# EAGLE design tremolo (EAGLE 9.3.0)

## Sheet 1 of 3
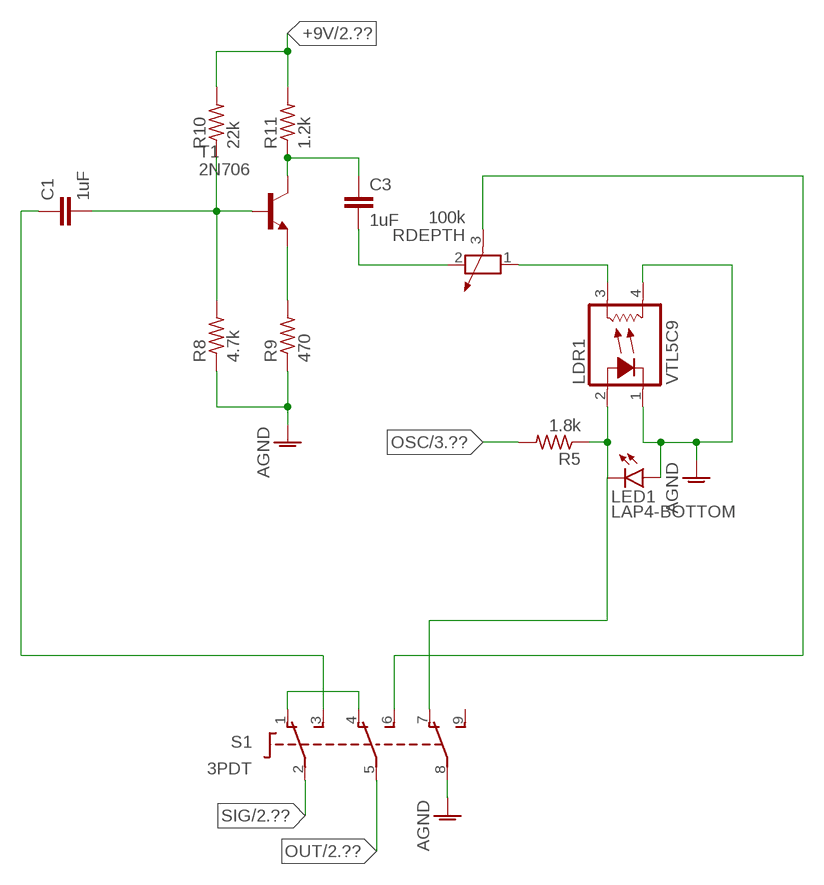
[diagram p0: schematic, sheet 1]

### Parts
C1  1uF  C-EU025-024X044  [C025-024X044]
C3  1uF  C-EU025-024X044  [C025-024X044]
LDR1  VTL5C9  [VTL5C]
LED1  LAP4-BOTTOM  [P47F-BOTTOM]
R5  1.8k  R-US_0204/2V  [0204V]
R8  4.7k  R-US_0204/2V  [0204V]
R9  470  R-US_0204/2V  [0204V]
R10  22k  R-US_0204/2V  [0204V]
R11  1.2k  R-US_0204/2V  [0204V]
RDEPTH  100k  POTENTIOMETER_PT-10  [PT-10]
S1  3PDT  [3PDT]
T1  2N706  [TO18]

### Nets
+9V: R10.2 R11.2 ; also sheet 2,3
AGND: LDR1.1(C) LDR1.4(L2) LED1.A R8.1 R9.1 S1.8(P3) ; also sheet 2,3
EFX: C3.1 R11.1 RDEPTH.3 S1.6(S2) T1.3(C)
IN: C1.1 S1.3(S1)
N$1: R9.2 T1.1(E)
N$2: C1.2 R8.2 R10.1 T1.2(B)
N$5: LDR1.2(A) LED1.C R5.1 S1.7(O3)
N$7: LDR1.3(L1) RDEPTH.1
N$8: S1.1(O1) S1.4(O2)
N$10: C3.2 RDEPTH.2
OSC: R5.2 ; also sheet 3
OUT: S1.5(P2) ; also sheet 2
SIG: S1.2(P1) ; also sheet 2
Unconnected: S1.9(S3)

## Sheet 2 of 3
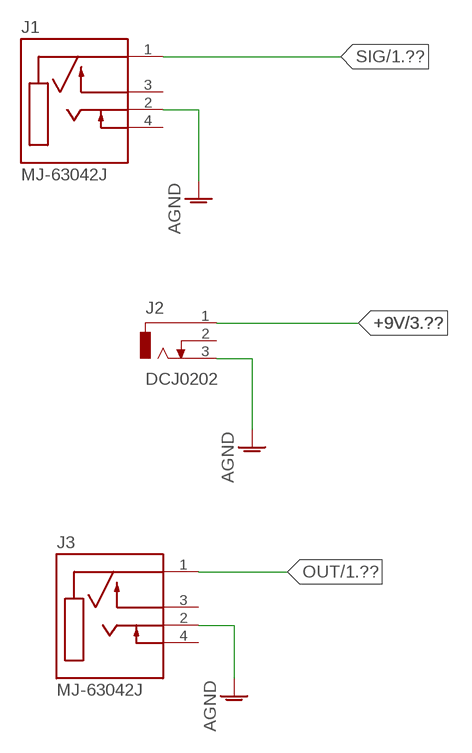
[diagram p1: schematic, sheet 2]

### Parts
J1  MJ-63042J  [CUI_MJ-63042J]
J2  DCJ0202  [DCJ0202]
J3  MJ-63042J  [CUI_MJ-63042J]

### Nets
+9V: J2.1 ; also sheet 1,3
AGND: J1.2(TIP) J2.3 J3.2(TIP) ; also sheet 1,3
OUT: J3.1(SLEEVE) ; also sheet 1
SIG: J1.1(SLEEVE) ; also sheet 1
Unconnected: J1.3(SLEEVE_SWITCH) J1.4(TIP_SWITCH) J2.2 J3.3(SLEEVE_SWITCH) J3.4(TIP_SWITCH)

## Sheet 3 of 3
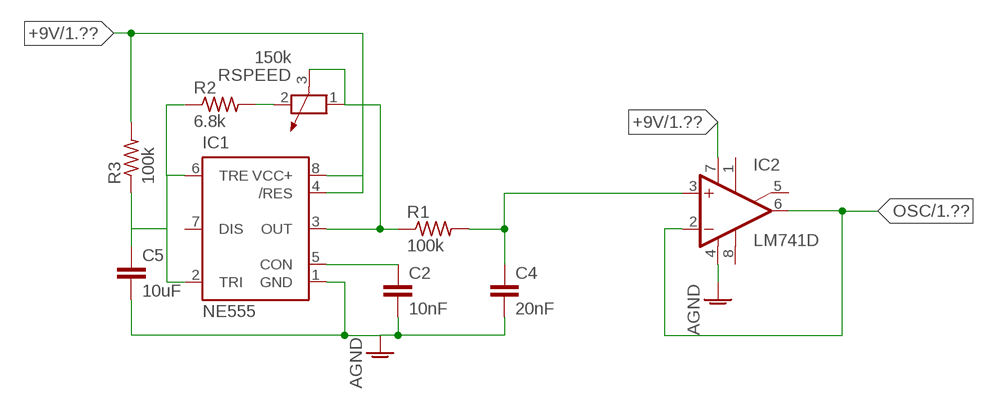
[diagram p2: schematic, sheet 3]

### Parts
C2  10nF  C-EU025-024X044  [C025-024X044]
C4  20nF  C-EU025-024X044  [C025-024X044]
C5  10uF  C-EU025-024X044  [C025-024X044]
IC1  NE555  [DIL-08]
IC2  LM741D  [SO08]
R1  100k  R-US_0204/2V  [0204V]
R2  6.8k  R-US_0204/2V  [0204V]
R3  100k  R-US_0204/2V  [0204V]
RSPEED  150k  POTENTIOMETER_PT-10  [PT-10]

### Nets
+9V: IC1.4(/RES) IC1.8(VCC+) IC2.7(V+) R3.2 ; also sheet 1,2
AGND: C2.2 C4.2 C5.2 IC1.1(GND) IC2.4(V-) ; also sheet 1,2
N$3: C2.1 IC1.5(CON)
N$4: IC1.3(OUT) R1.1 RSPEED.1 RSPEED.3
N$6: C5.1 IC1.2(TRI) IC1.6(TRE) R2.1 R3.1
N$9: R2.2 RSPEED.2
OSC: IC2.2(-IN) IC2.6(OUT) ; also sheet 1
WAV: C4.1 IC2.3(+IN) R1.2
Unconnected: IC1.7(DIS) IC2.1(ON1) IC2.5(ON2) IC2.8(OPT)

## Library data of the parts
C1-C5 = rcl:C-EU: CAPACITOR, European symbol; SPICEPREFIX: C
IC1 = st-microelectronics:NE555: General purpose bipolar Timer; MF: Arrow Electronics; MPN: NE555N; OC_FARNELL: 1467742; OC_NEWARK: 89K1486
IC2 = linear:*741: OP AMP
J1 J3 = MJ-63042J:MJ-63042J: Check prices <https://snapeda.com/parts/MJ-63042J/CUI%20Devices/view-part/?ref=eda>; ARROW_ELECTRONICS-PURCHASE-URL: https://snapeda.com/shop?store=Arrow+Electronics&id=4973935; AVAILABILITY: Warning; CUI_PURCHASE_URL: https://www.cuidevices.com/product/interconnect/connectors/audio-connectors/jacks/mj-63042j?utm_source=snapeda.com&utm_medium=referral&utm_campaign=snapedaBOM; DESCRIPTION: 6.35 mm, Mono, Right Angle, Through Hole, 2 Conductors, 2 Internal Switches, Audio Jack Connector; DIGIKEY-PURCHASE-URL: https://snapeda.com/shop?store=DigiKey&id=4973935; MF: CUI Devices; MOUSER-PURCHASE-URL: https://snapeda.com/shop?store=Mouser&id=4973935; MP: MJ-63042J; PACKAGE: Package; PRICE: None
J2 = con-jack:DCJ0202: DC POWER JACK Source: DCJ0202.pdf; OC_FARNELL: unknown; OC_NEWARK: unknown; SPICEPREFIX: M
LDR1 = optocoupler:VTL5C*: Low Cost Axial Vactrols Source: www.perkinelmer.com/opto ... vtl5c9_c10.pdf; MF: VACTEC PHOTO; MPN: VTL5C9; OC_FARNELL: 2067857; OC_NEWARK: 95F9033
LED1 = led:*P4: PointLED® Enhanced Thinfilm LED TOP & BOTTOM mount LS P47F, LR P47F, LA P47F, LY P47F, LT P4SG, LB P4SG, LW P4SG Source: http://catalog.osram-os.com .. LA_LR_LS_LY_P47F_Pb_free.pdf
R1-R3 R5 R8-R11 = rcl:R-US_: RESISTOR, American symbol; SPICEPREFIX: R
RDEPTH RSPEED = rcl:POTENTIOMETER_: Potentiometer; SPICEMODEL: POT; SPICEPREFIX: X
S1 = switch:3PDT: 3PDT 9 pin footswitch SF17020F-0302-21R-L Source: 3PDT.jpg
T1 = transistor:2N706: NPN TRANSISTOR

## Board
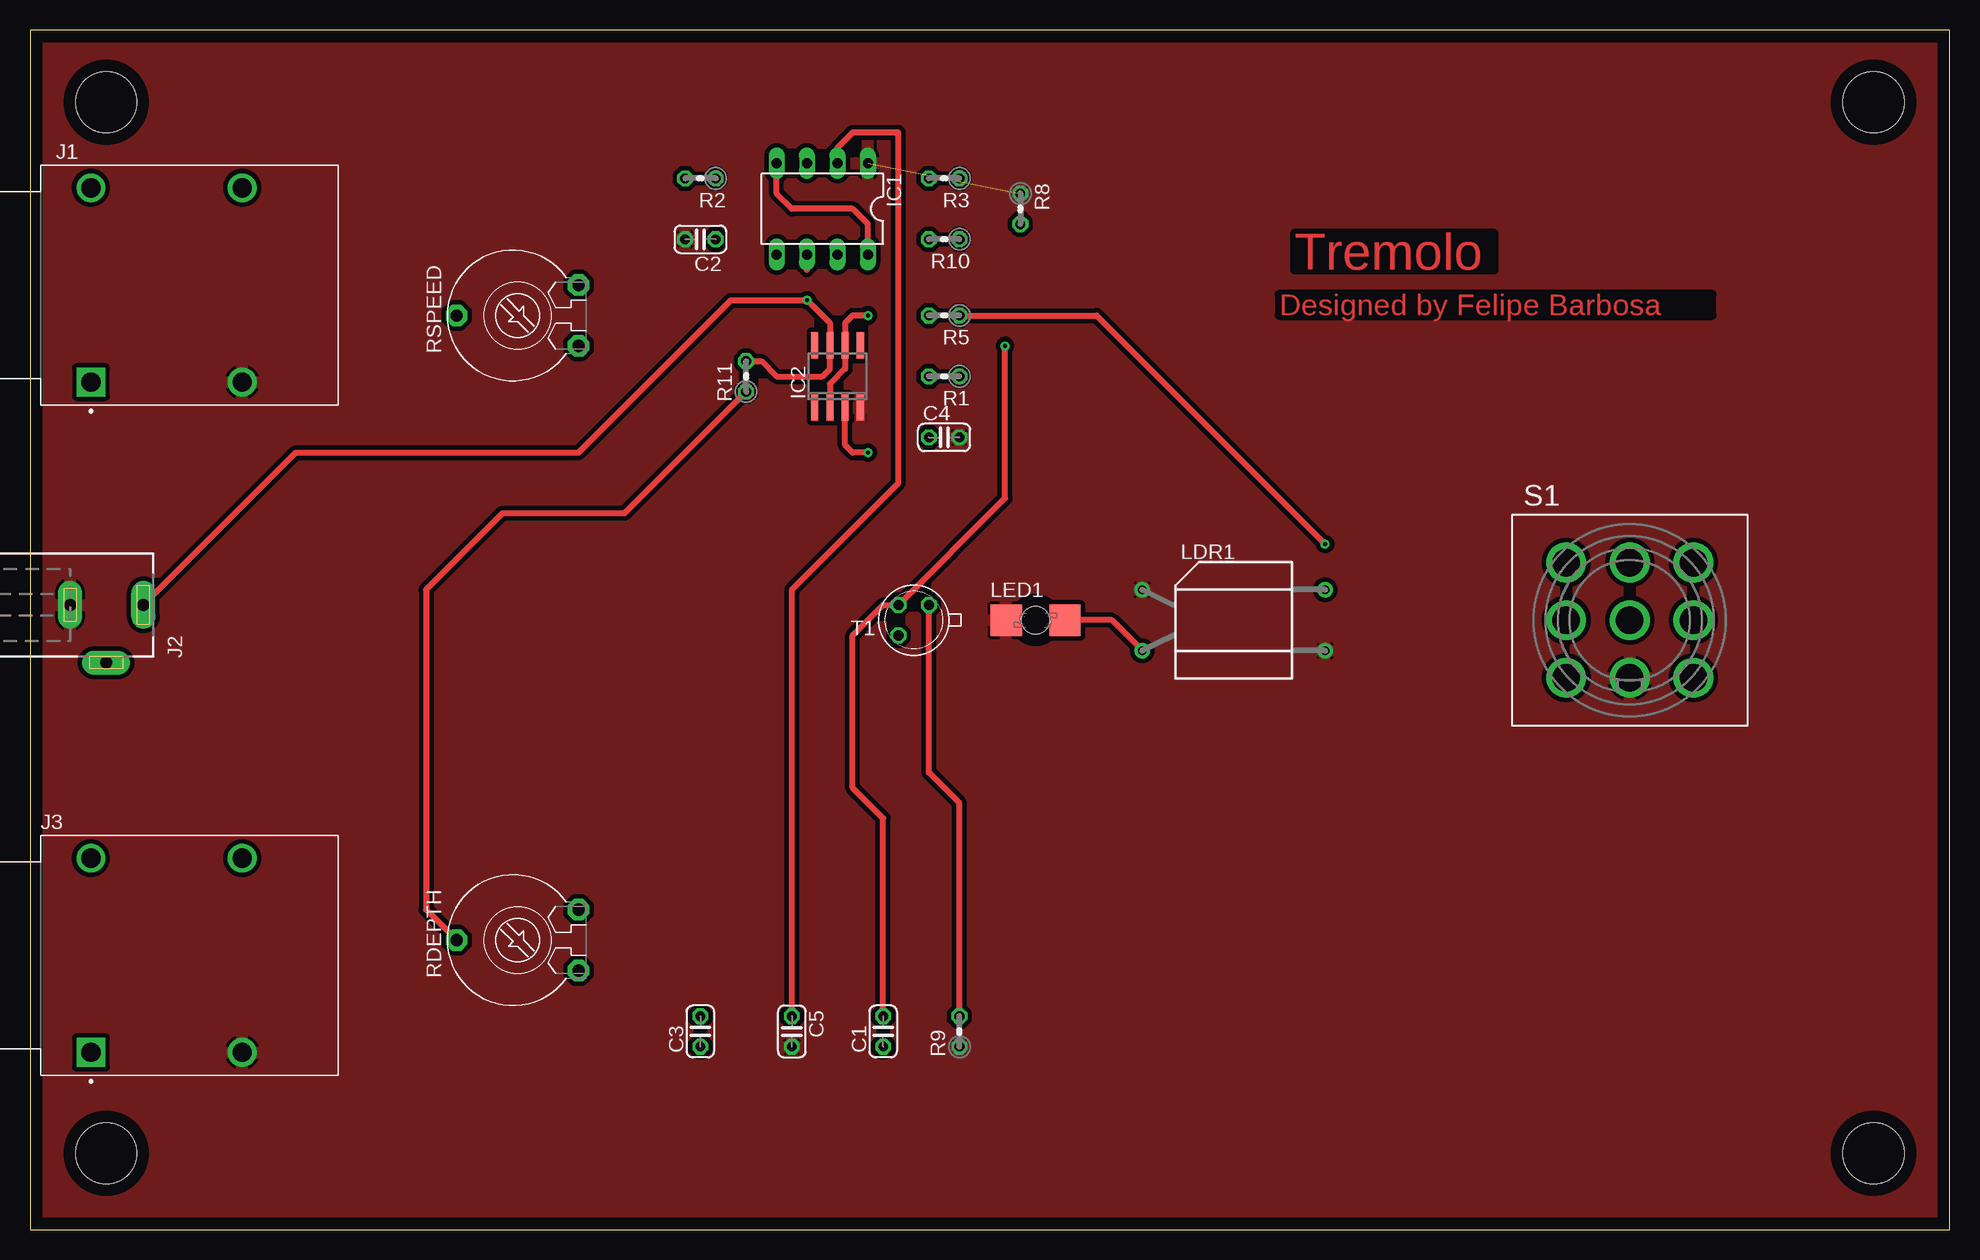
[diagram p3: board, top side]
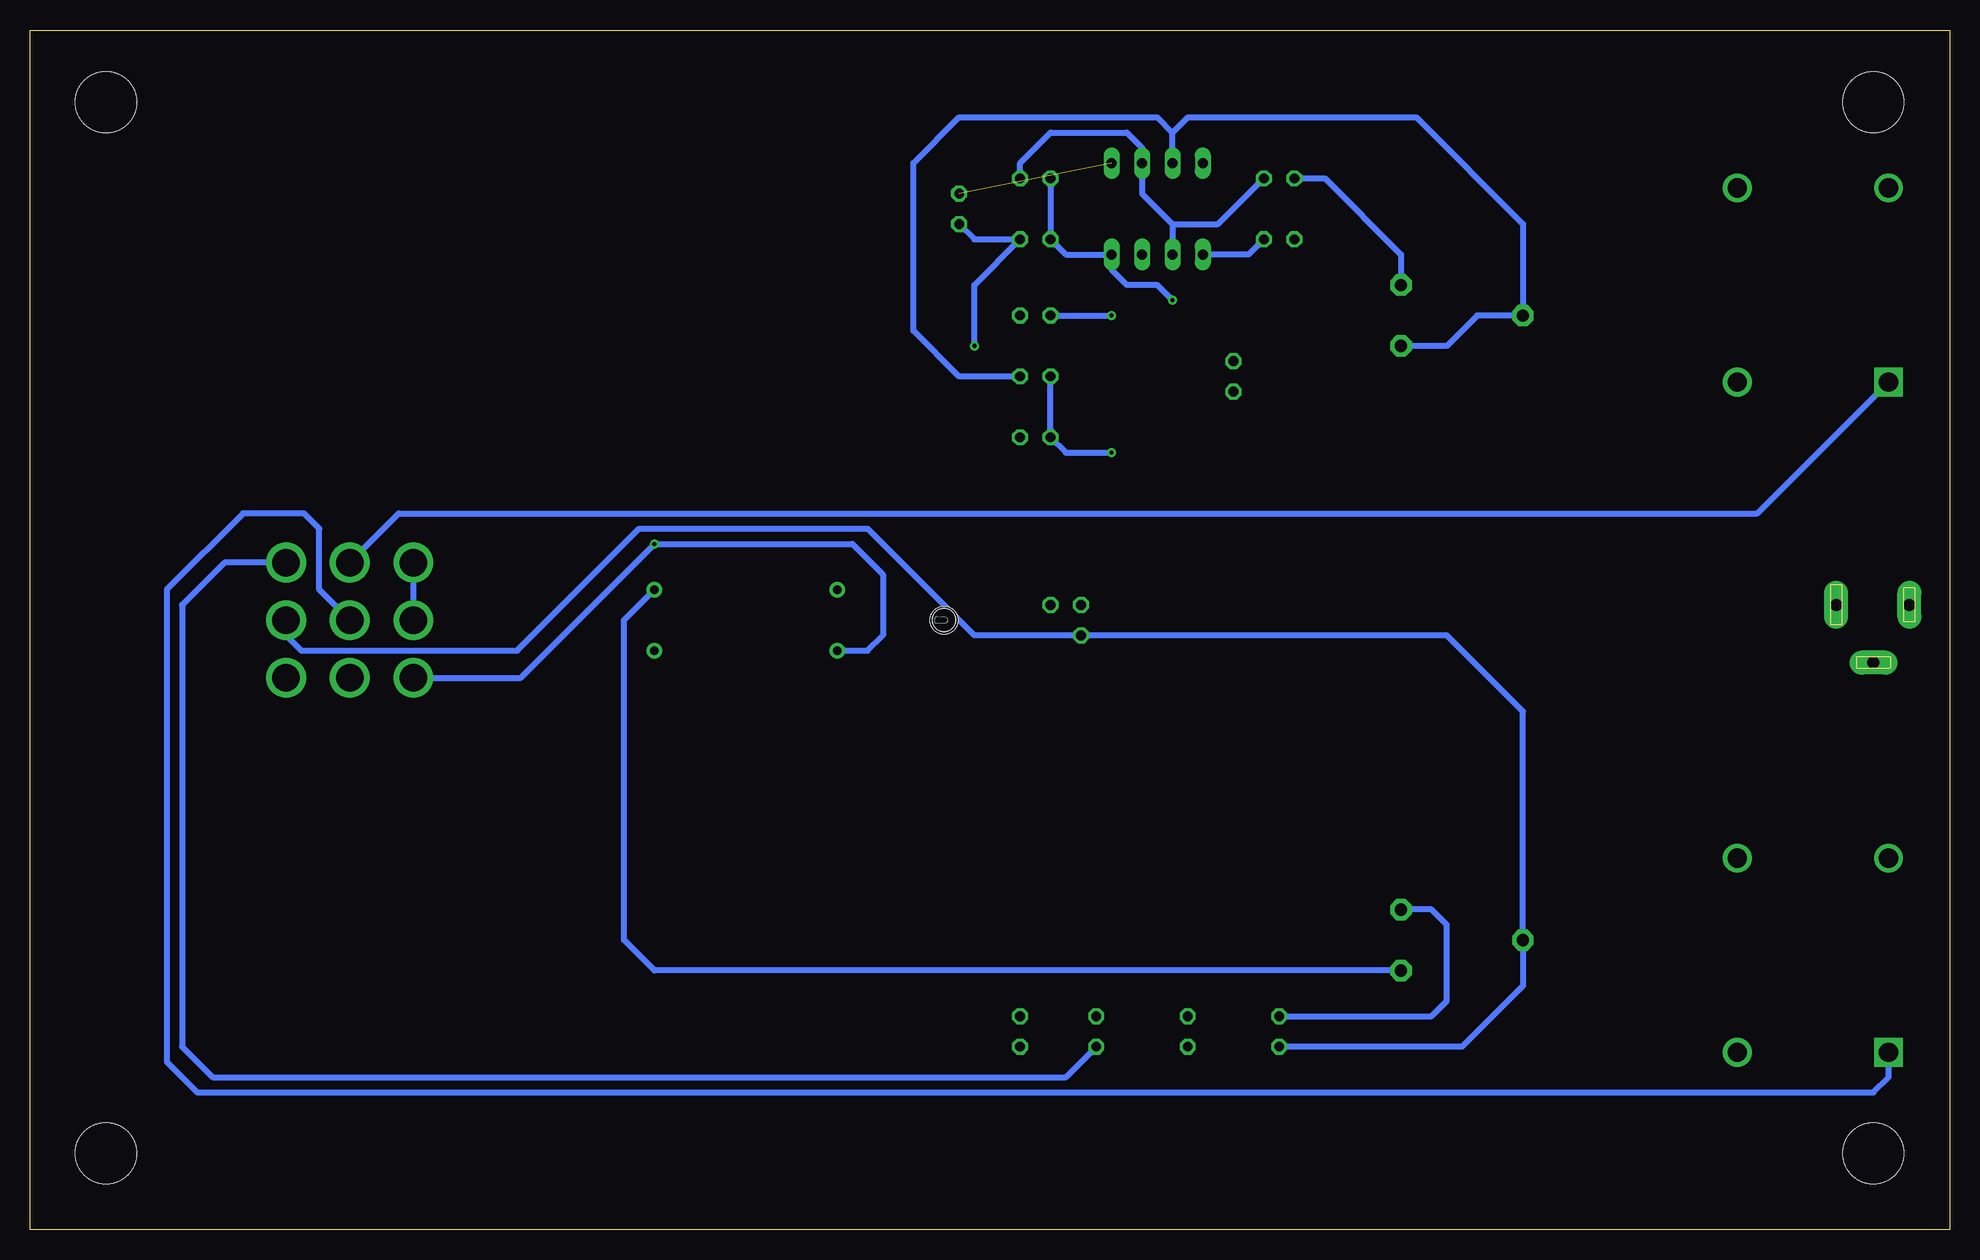
[diagram p4: board, bottom side, seen from below]

Size 160 x 100 mm. Coordinates in mm from the lower left corner, seen from the top.
Outline: 0,0 160,0 160,100 0,100 0,0
Copper layers (1*16): Top 0.035mm / dielectric 1.5mm / Bottom 0.035mm
Design rules "default": minimum track width 6mil, minimum drill 0.35mm, track to track 6mil, track to pad 6mil, pad to pad 6mil, via to via 6mil, smd to smd 6mil, copper to edge 40mil, drill to drill 6mil, minimum pad ring 10mil, minimum via ring 8mil, stop-mask expansion 4mil, vias tented up to drill 0mil, thermal gap 10mil
Holes 5.08 mm at 6.35,93.98 6.35,6.35 153.67,6.35 153.67,93.98

### Footprints (pad centres in the part's own frame; a part is rotated, then mirrored left to right if it is on the bottom)
C025-024X044 = drill 0.813 octagon: 1 -1.27,0; 2 1.27,0
DIL-08 = drill 0.813 long: 1 -3.81,-3.81; 2 -1.27,-3.81; 3 1.27,-3.81; 4 3.81,-3.81; 5 3.81,3.81; 6 1.27,3.81; 7 -1.27,3.81; 8 -3.81,3.81
SO08 = smd 0.6 x 2.2: 1 -1.905,-2.6; 2 -0.635,-2.6; 3 0.635,-2.6; 4 1.905,-2.6; 5 1.905,2.6; 6 0.635,2.6; 7 -0.635,2.6; 8 -1.905,2.6
CUI_MJ-63042J = drill 1.6 square: 1 0,-8.1 | drill 1.6: 2 12.6,-8.1; 3 0,8.1; 4 12.6,8.1
DCJ0202 = drill 1 pad 2 long: 1 0,3.1; 2 4.8,0; 3 0,-3
VTL5C = drill 0.7 pad 1.3: 1 -7.62,2.54; 2 -7.62,-2.54; 3 7.62,2.54; 4 7.62,-2.54
P47F-BOTTOM = smd 2.6 x 2.6: A -2.45,0; C 2.45,0 | hole 2.3: 0,0
0204V = drill 0.813 octagon: 1 -1.27,0; 2 1.27,0
PT-10 = drill 1.016 pad 1.778 octagon: 1 -2.54,-5.08; 2 2.54,-5.08; 3 0,5.08
3PDT = drill 2.3 pad 3.1: 1 -5.3,4.8; 2 0,4.8; 3 5.3,4.8; 4 -5.3,0; 5 0,0; 6 5.3,0; 7 -5.3,-4.8; 8 0,-4.8; 9 5.3,-4.8
TO18 = drill 0.813 octagon: 1 -1.27,-1.27; 2 1.27,-1.27; 3 1.27,1.27

### Placement (x,y rotation side)
C1  71.12,16.51 90 top
C2  55.88,82.55 180 top
C3  55.88,16.51 90 top
C4  76.2,66.04 0 top
C5  63.5,16.51 270 top
IC1  66.04,85.09 180 top
IC2  67.31,71.12 0 top
J1  5.08,78.74 0 top
J2  6.35,52.07 270 top
J3  5.08,22.86 0 top
LDR1  100.33,50.8 0 top
LED1  83.82,50.8 0 top
R1  76.2,71.12 180 top
R2  55.88,87.63 180 top
R3  76.2,87.63 180 top
R5  76.2,76.2 180 top
R8  82.55,85.09 270 top
R9  77.47,16.51 90 top
R10  76.2,82.55 180 top
R11  59.69,71.12 90 top
RDEPTH  40.64,24.13 90 top
RSPEED  40.64,76.2 90 top
S1  133.35,50.8 0 top
T1  73.66,50.8 180 top

### Tracks (layer width: path | path; a pad name or v marks a point on that pad's centre or on a via)
+9V  (via drill 0.35)
  Top 0.508: J2.1 22.15,64.77 45.72,64.77 58.42,77.47 v64.77,77.47 66.67,75.56 IC2.7 66.67,71.75 66.05,71.12 62.23,71.12 60.96,72.39 R11.2 | IC1.8 69.85,83.82 68.58,85.09 63.5,85.09 62.23,86.36 IC1.4
  Bottom 0.508: v64.77,77.47 66.04,78.74 68.58,78.74 69.85,80.01 IC1.8 73.66,81.28 R10.2 R3.2
AGND  (1 unrouted)
  pour Top (isolate 0.381): 1.27,99.06 1.27,1.27 158.75,1.27 158.75,99.06
EFX
  Top 0.508: RDEPTH.3 33.02,26.67 33.02,53.34 39.37,59.69 49.53,59.69 R11.1
  Bottom 0.508: S1.6 138.65,49.53 137.38,48.26 119.38,48.26 109.22,58.42 90.17,58.42 81.28,49.53 T1.3 41.91,49.53 35.56,43.18 RDEPTH.3 35.56,20.32 40.64,15.24 C3.1
IN
  Bottom 0.508: S1.3 143.79,55.6 147.32,52.07 147.32,15.24 144.78,12.7 73.66,12.7 C1.1
N$1
  Top 0.508: R9.2 77.47,35.56 74.93,38.1 T1.1
N$2  (via drill 0.35)
  Top 0.508: C1.2 71.12,34.29 68.58,36.83 68.58,49.53 71.12,52.07 T1.2 81.28,60.96 v81.28,73.66
  Bottom 0.508: R8.2 81.28,82.55 R10.1 81.28,78.74 v81.28,73.66
N$3
  Bottom 0.508: C2.1 58.42,81.28 IC1.5
N$4
  Bottom 0.508: 64.77,91.44 63.5,92.71 44.45,92.71 35.56,83.82 RSPEED.3 39.37,76.2 41.91,73.66 RSPEED.1 | IC1.3 64.77,91.44 | R1.1 82.55,71.12 86.36,74.93 86.36,88.9 82.55,92.71 66.04,92.71 64.77,91.44
N$5  (via drill 0.35)
  Top 0.508: LDR1.2 90.17,50.8 LED1.C | R5.1 88.9,76.2 v107.95,57.15
  Bottom 0.508: S1.7 119.1,46 v107.95,57.15 91.44,57.15 88.9,54.61 88.9,49.53 90.17,48.26 LDR1.2
N$6
  Top 0.508: C5.1 63.5,53.34 72.39,62.23 72.39,91.44 68.58,91.44 67.31,90.17 IC1.2 | 64.77,80.01 IC1.6
  Bottom 0.508: 64.77,83.82 IC1.6 | 64.77,83.82 67.31,86.36 IC1.2 67.31,90.17 68.58,91.44 74.93,91.44 77.47,88.9 R3.1 | 64.77,83.82 60.96,83.82 R2.1
N$7
  Bottom 0.508: LDR1.3 110.49,50.8 110.49,33.02 110.49,24.13 107.95,21.59 RDEPTH.1
N$8
  Bottom 0.508: S1.1 S1.4
N$9
  Bottom 0.508: R2.2 52.07,87.63 45.72,81.28 RSPEED.2
N$10
  Bottom 0.508: C3.2 43.18,17.78 41.91,19.05 41.91,25.4 43.18,26.67 RDEPTH.2
OSC  (via drill 0.35)
  Top 0.508: IC2.2 66.67,70.48 67.94,71.75 IC2.6 67.94,75.56 68.58,76.2 v69.85,76.2
  Bottom 0.508: R5.2 v69.85,76.2
OUT
  Bottom 0.508: S1.5 135.89,53.34 135.89,58.42 137.16,59.69 142.24,59.69 148.59,53.34 148.59,13.97 146.05,11.43 6.35,11.43 5.08,12.7 J3.1
SIG
  Bottom 0.508: S1.2 129.26,59.69 16.03,59.69 J1.1
WAV  (via drill 0.35)
  Top 0.508: v69.85,64.77 68.58,64.77 67.94,65.41 IC2.3
  Bottom 0.508: R1.2 C4.1 73.66,64.77 v69.85,64.77

### Text on the board
Top: Tremolo | Designed by Felipe Barbosa